# EAGLE design ecu1 (EAGLE 9.0.0)
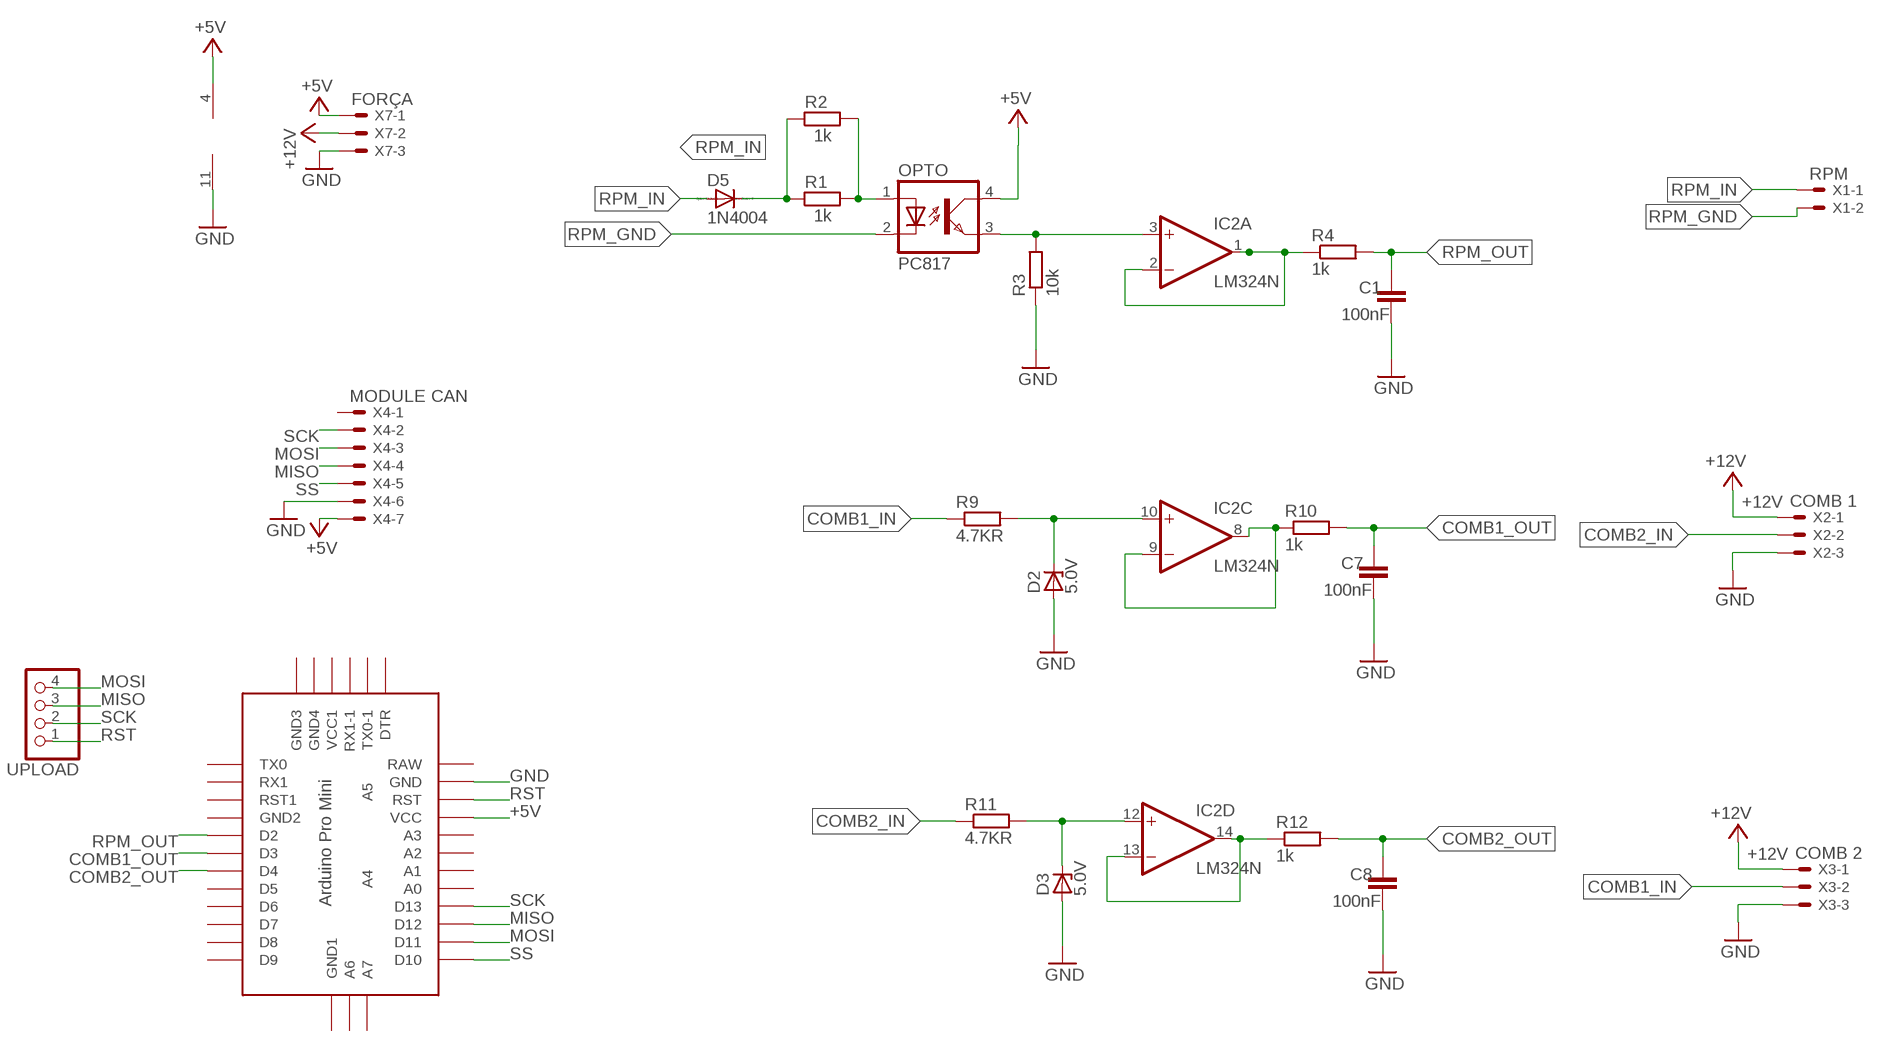
[diagram p0: schematic, sheet 1]

## Parts
C1  100nF  C5/2.5  [C5B2.5]
C7  100nF  C5/2.5  [C5B2.5]
C8  100nF  C5/2.5  [C5B2.5]
D2  5.0V  ZENER-DIODEDO34-7  [DO34Z7]
D3  5.0V  ZENER-DIODEDO34-7  [DO34Z7]
D5  1N4004  [DO41-10]
IC2  LM324N  [DIL14]
OPTO  PC817  [DIL04]
R1  1k  R-EU_0207/7  [0207/7]
R2  1k  R-EU_0207/7  [0207/7]
R3  10k  R-EU_0207/7  [0207/7]
R4  1k  R-EU_0207/7  [0207/7]
R9  4.7KR  R-EU_0207/7  [0207/7]
R10  1k  R-EU_0207/7  [0207/7]
R11  4.7KR  R-EU_0207/7  [0207/7]
R12  1k  R-EU_0207/7  [0207/7]
U$1  ABK-PRO-MINI  [ABK-PRO-MINI]
UPLOAD  PINHD-1X4  [1X04]
X1  RPM  22-23-2021  [22-23-2021]
X2  COMB 1  22-23-2031  [22-23-2031]
X3  COMB 2  22-23-2031  [22-23-2031]
X4  MODULE CAN  22-23-2071  [22-23-2071]
X7  FORÇA  22-23-2031  [22-23-2031]

## Nets
+5V [ALIMENTACAO]: IC2.4(P:V+) OPTO.4(COL) U$1.VCC X4.7 X7.1
+12V [ALIMENTACAO]: X2.1 X3.1 X7.2
COMB1_IN [ALIMENTACAO]: R9.1 X3.2
COMB1_OUT: C7.2 R10.2 U$1.D3
COMB2_IN [ALIMENTACAO]: R11.1 X2.2
COMB2_OUT: C8.2 R12.2 U$1.D4
GND [ALIMENTACAO]: C1.1 C7.1 C8.1 D2.A D3.A IC2.11(P:V-) R3.1 U$1.GND X2.3 X3.3 X4.6 X7.3
MISO: U$1.D12 UPLOAD.3 X4.4
MOSI: U$1.D11 UPLOAD.4 X4.3
N$1 [ALIMENTACAO]: OPTO.1(A) R1.2 R2.2
N$2 [ALIMENTACAO]: D5.C R1.1 R2.1
N$3 [ALIMENTACAO]: IC2.1(A:OUT) IC2.2(A:-IN) R4.1
N$5: D2.C IC2.10(C:+IN) R9.2
N$7 [ALIMENTACAO]: IC2.3(A:+IN) OPTO.3(EMIT) R3.2
N$12: IC2.8(C:OUT) IC2.9(C:-IN) R10.1
N$13: D3.C IC2.12(D:+IN) R11.2
N$14: IC2.13(D:-IN) IC2.14(D:OUT) R12.1
RPM_GND [ALIMENTACAO]: OPTO.2(C) X1.2
RPM_IN [ALIMENTACAO]: D5.A X1.1
RPM_OUT [ALIMENTACAO]: C1.2 R4.2 U$1.D2
RST: U$1.RST UPLOAD.1
SCK: U$1.D13 UPLOAD.2 X4.2
SS: U$1.D10 X4.5
Unconnected: IC2.5(B:+IN) IC2.6(B:-IN) IC2.7(B:OUT) U$1.A0 U$1.A1 U$1.A2 U$1.A3 U$1.A4 U$1.A5 U$1.A6 U$1.A7 U$1.D5 U$1.D6 U$1.D7 U$1.D8 U$1.D9 U$1.DTR U$1.GND1(GND2) U$1.GND2(GND3) U$1.GND3(GND4) U$1.GND4(GND1) U$1.RAW U$1.RST1 U$1.RX1 U$1.RX1-1 U$1.TX0 U$1.TX0-1 U$1.VCC1 X4.1

## Library data of the parts
C1 C7 C8 = capacitor-wima:C: CAPACITOR naming: grid - package width
D2 D3 = diode:ZENER-DIODE: Z-Diode
D5 = diode:1N4004: DIODE general purpose rectifier, 1 A
IC2 = linear:LM324: OP AMP
OPTO = optocoupler:PC817: SHARP OPTO COUPLER; MPN: PC817X4J000F; OC_FARNELL: 9707727; OC_NEWARK: 97K7059
R1-R4 R9-R12 = resistor:R-EU_: RESISTOR, European symbol
U$1 = Arduino-clone:ABK-PRO-MINI: ABK Pro-Mini Arduino Clone
UPLOAD = pinhead:PINHD-1X4: PIN HEADER
X1 = con-molex:22-23-2021: .100" (2.54mm) Center Header - 2 Pin; MF: MOLEX; MPN: 22-23-2021; OC_FARNELL: 1462926; OC_NEWARK: 25C3832
X2 X3 X7 = con-molex:22-23-2031: .100" (2.54mm) Center Header - 3 Pin; MF: MOLEX; MPN: 22-23-2031; OC_FARNELL: 1462950; OC_NEWARK: 30C0862
X4 = con-molex:22-23-2071: .100" (2.54mm) Center Header - 7 Pin; MF: MOLEX; MPN: 22-23-2071; OC_FARNELL: 1654534; OC_NEWARK: 56H0445

## Net classes
0 default: width 1.27 mm
1 ALIMENTACAO: width 0.635 mm

## Board
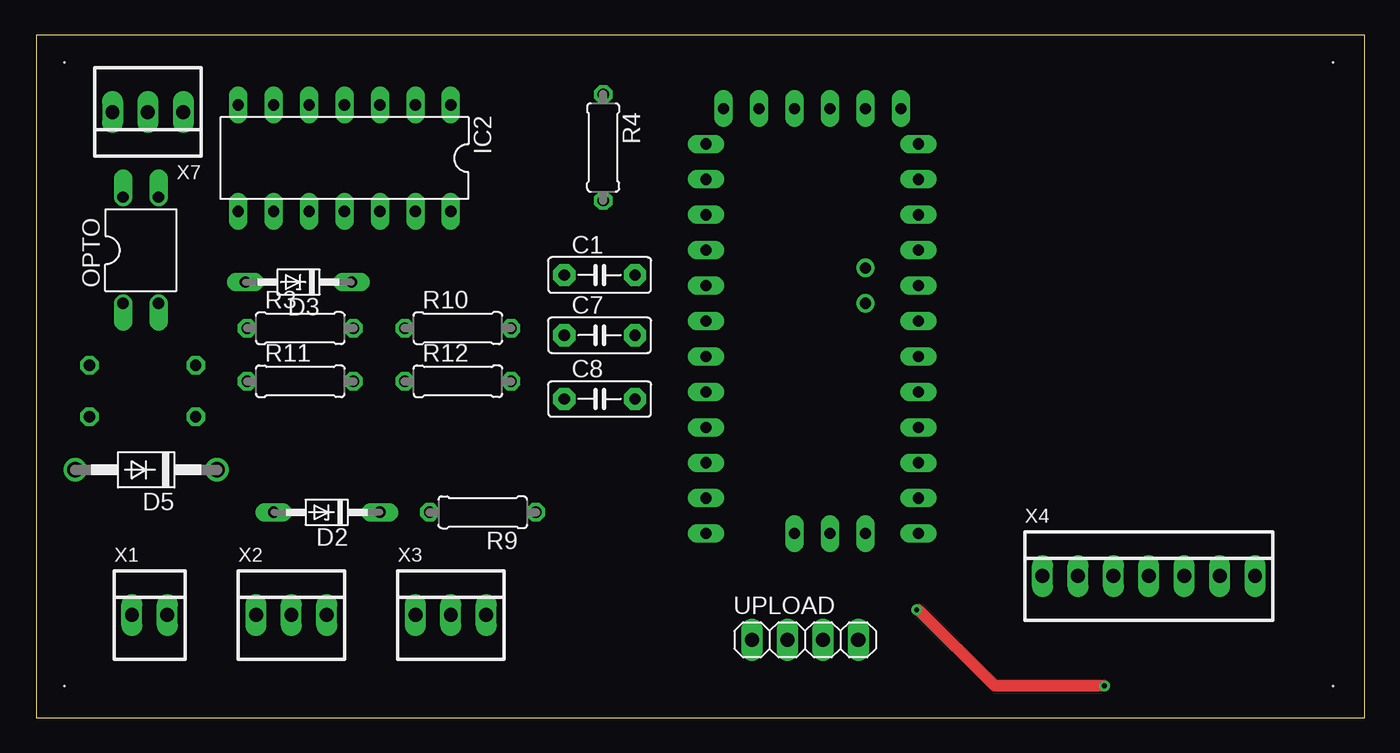
[diagram p1: board, top side]
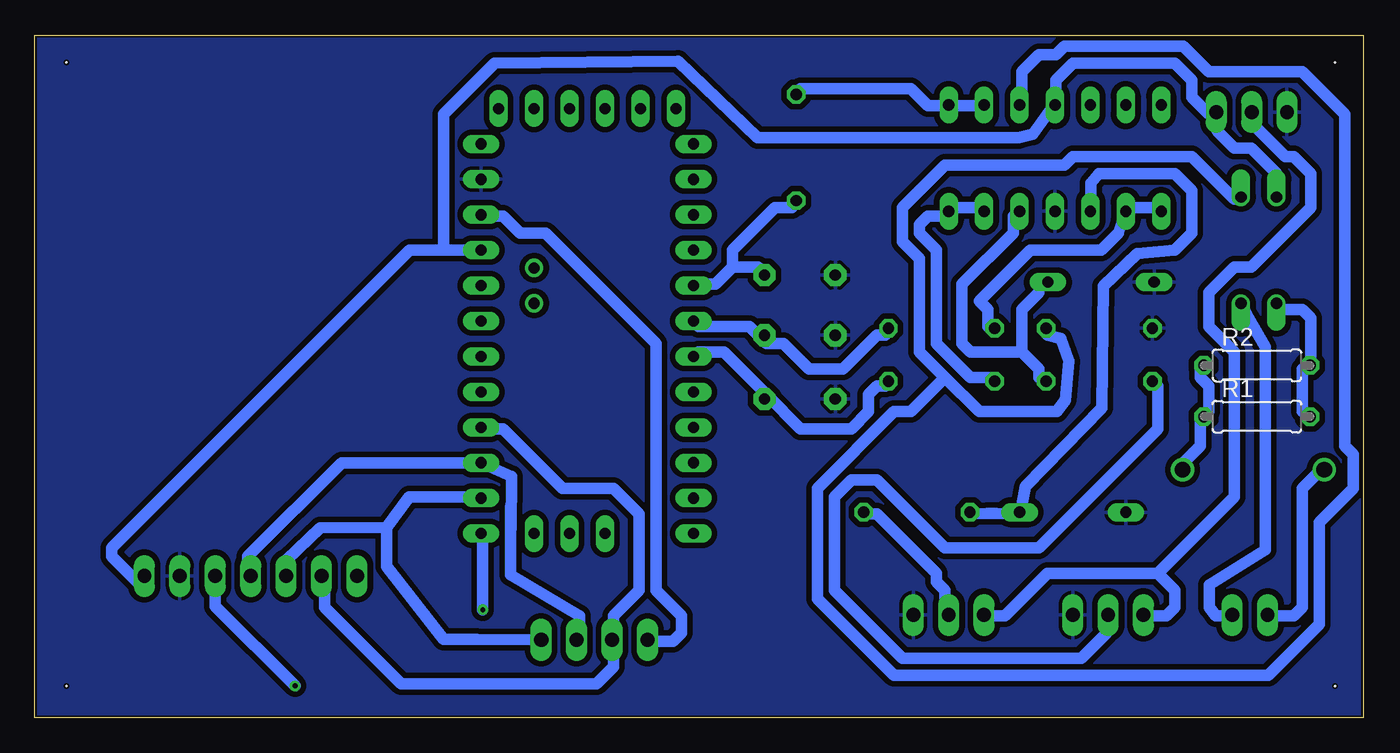
[diagram p2: board, bottom side, seen from below]

Size 95.23 x 48.95 mm. Coordinates in mm from the lower left corner, seen from the top.
Outline: 0,0 95.23,0 95.23,48.95 0,48.95 0,0
Copper layers (1*16): Top 0.035mm / dielectric 1.5mm / Bottom 0.035mm
Design rules "default *": minimum track width 32mil, minimum drill 0.35mm, track to track 16mil, track to pad 16mil, pad to pad 16mil, via to via 16mil, smd to smd 16mil, copper to edge 6mil, drill to drill 6mil, minimum pad ring 10mil, minimum via ring 8mil, stop-mask expansion 4mil, vias tented up to drill 0mil, thermal gap 10mil
Holes 0.08 mm at 2.03,46.99 92.96,46.99 92.96,2.29 2.03,2.29

### Footprints (pad centres in the part's own frame; a part is rotated, then mirrored left to right if it is on the bottom)
C5B2.5 = drill 0.813 pad 1.6 octagon: 1 -2.54,0; 2 2.54,0
DO34Z7 = drill 0.813 long: A 3.81,0; C -3.81,0
DO41-10 = drill 1.118: A 5.08,0; C -5.08,0
DIL14 = drill 0.813 long: 1 -7.62,-3.81; 2 -5.08,-3.81; 3 -2.54,-3.81; 4 0,-3.81; 5 2.54,-3.81; 6 5.08,-3.81; 7 7.62,-3.81; 8 7.62,3.81; 9 5.08,3.81; 10 2.54,3.81; 11 0,3.81; 12 -2.54,3.81; 13 -5.08,3.81; 14 -7.62,3.81
DIL04 = drill 0.813 offset: 1 -1.27,-3.81; 2 1.27,-3.81; 3 1.27,3.81; 4 -1.27,3.81
0207/7 = drill 0.813 octagon: 1 -3.81,0; 2 3.81,0
ABK-PRO-MINI = drill 0.8 long: A0 10.16,-3.81; A1 10.16,-6.35; A2 10.16,-8.89; A3 10.16,-11.43; A6 3.81,-21.59; A7 6.35,-21.59; D2 -5.08,-3.81; D3 -5.08,-6.35; D4 -5.08,-8.89; D5 -5.08,-11.43; D6 -5.08,-13.97; D7 -5.08,-16.51; D8 -5.08,-19.05; D9 -5.08,-21.59; D10 10.16,-21.59; D11 10.16,-19.05; D12 10.16,-16.51; D13 10.16,-13.97; DTR 8.89,8.89; GND 10.16,3.81; GND1 -5.08,-1.27; GND2 -3.81,8.89; GND3 -1.27,8.89; GND4 1.27,-21.59; RAW 10.16,6.35; RST 10.16,1.27; RST1 -5.08,1.27; RX1 -5.08,3.81; RX1-1 3.81,8.89; TX0 -5.08,6.35; TX0-1 6.35,8.89; VCC 10.16,-1.27; VCC1 1.27,8.89 | drill 0.8: A4 6.35,-5.08; A5 6.35,-2.54
1X04 = drill 1.016 long: 1 -3.81,0; 2 -1.27,0; 3 1.27,0; 4 3.81,0
22-23-2021 = drill 1 long: 1 -1.27,0; 2 1.27,0
22-23-2031 = drill 1 long: 1 -2.54,0; 2 0,0; 3 2.54,0
22-23-2071 = drill 1 long: 1 -7.62,0; 2 -5.08,0; 3 -2.54,0; 4 0,0; 5 2.54,0; 6 5.08,0; 7 7.62,0

### Placement (x,y rotation side)
C1  40.39,31.75 0 top
C7  40.39,27.43 0 top
C8  40.39,22.86 0 top
D2  20.83,14.73 180 top
D3  18.8,31.24 180 top
D5  7.87,17.78 180 top
IC2  22.1,40.13 180 top
OPTO  7.49,33.53 0 top
R1  7.62,21.59 0 bottom
R2  7.62,25.27 0 bottom
R3  18.92,27.94 0 top
R4  40.64,40.89 270 top
R9  32,14.73 180 top
R10  30.23,27.94 0 top
R11  18.92,24.13 0 top
R12  30.23,24.13 0 top
U$1  53.09,34.8 0 top
UPLOAD  55.12,5.59 0 top
X1  8.13,7.37 0 top
X2  18.29,7.37 0 top
X3  29.72,7.37 0 top
X4  79.76,10.16 0 top
X7  8,43.43 180 top

### Tracks (layer width: path | path; a pad name or v marks a point on that pad's centre or on a via)
+5V
  Bottom 0.813: OPTO.4 6.2,37.8 6.2,39.01 8.03,40.84 9.25,40.84 10.46,42.06 10.46,43.28 X7.1 11.07,43.28 12.29,44.5 12.29,45.72 13.51,46.94 20.83,46.94 22.05,45.72 22.05,44.5 IC2.4 22.05,44.14 23.7,41.83 24.69,41.6 43.41,41.6 49.12,47.07 62.28,46.94 65.94,43.28 65.94,33.53 | 65.94,33.53 68.38,33.53 89.71,12.19 89.71,11.58 87.88,9.75 X4.7 | 65.94,33.53 U$1.VCC
+12V
  Bottom 0.813: 14.73,10.36 13.51,9.14 13.51,7.93 14.12,7.32 15.34,7.32 X2.1 | 14.73,10.36 22.66,10.36 25.7,7.32 26.92,7.32 X3.1 | 14.73,10.36 9.25,15.85 9.25,26.21 11.07,28.04 11.07,30.48 9.25,32.31 8.03,32.31 3.76,36.58 3.76,39.01 4.98,40.23 5.59,40.23 8.03,42.67 8.03,43.28 X7.2
COMB1_IN
  Bottom 0.813: R9.1 35.46,14.63 34.85,14.63 30.58,10.36 30.58,9.75 29.97,9.14 29.97,7.93 X3.2
COMB1_OUT
  Bottom 0.813: 43.38,27.43 43.99,28.04 47.65,28.04 U$1.D3 | 43.38,27.43 42.77,26.82 41.55,26.82 39.73,24.99 37.29,24.99 34.85,27.43 34.24,27.43 R10.2 | 43.38,27.43 C7.2
COMB2_IN
  Bottom 0.813: R11.1 14.73,23.77 14.73,20.73 23.27,12.19 29.97,12.19 34.85,17.07 36.68,17.07 37.9,15.85 37.9,9.14 33.02,4.27 20.22,4.27 18.39,6.1 18.39,7.32 X2.2
COMB2_OUT
  Bottom 0.813: 42.77,23.17 45.82,26.21 47.65,26.21 U$1.D4 | 42.77,23.17 40.33,20.73 36.68,20.73 35.46,21.95 35.46,23.17 34.85,23.77 34.24,23.77 R12.2 | 42.77,23.17 C8.2
GND
  pour Bottom: 0.25,48.77 0.25,0.13 95,0.13 95,48.77
MISO
  Bottom 0.813: X4.4 79.96,10.36 79.96,11.58 73.25,18.29 U$1.D12 61.06,17.3 61.09,13.54 61.14,14.02 61.11,15.11 61.14,10.26 56.19,7.32 56.19,6.1 UPLOAD.3
MOSI
  Bottom 0.813: 70,13.64 70,10.85 65.91,5.61 63.55,5.61 UPLOAD.4 | 70,13.64 68.4,15.85 63.5,15.85 U$1.D11 | 70,13.64 74.78,13.61 77.19,11.33 77.19,9.09 X4.3
N$1
  Bottom 0.813: R1.2 4.37,21.95 4.37,24.99 R2.2 3.76,25.6 3.76,28.65 4.37,29.26 6.2,29.26 OPTO.1
N$2
  Bottom 0.813: R2.1 11.68,24.99 11.68,24.38 11.07,23.77 11.07,21.95 R1.1 11.68,21.34 11.68,19.51 12.9,18.29 D5.C
N$3
  Bottom 0.813: IC2.2 27.53,43.89 29.36,43.89 IC2.1 29.97,43.89 31.19,43.89 32.41,45.11 40.33,45.11 R4.1
N$5
  Bottom 0.813: R9.2 28.14,14.63 26.95,14.66 26.34,14.66 25.09,14.63 D2.C 24.49,15.24 24.23,16.59 18.74,22.2 18.62,30.96 16.18,33.27 13.51,33.53 12.29,34.75 12.29,37.8 13.51,39.01 18.95,39.01 19.51,38.35 19.51,37.21 19.56,36.65 IC2.10
N$7
  Bottom 0.813: 29.97,24.38 31.8,26.21 31.8,32.92 33.02,34.14 33.02,36.58 29.97,39.62 21.44,39.62 20.83,40.23 12.29,40.23 9.25,37.19 OPTO.3 | 29.97,24.38 27.53,21.95 21.95,21.95 21.36,22.78 21.11,25.58 21.69,27.18 22.66,27.43 R3.2 | 29.97,24.38 32.41,21.95 33.63,21.95 39.12,16.46 39.12,8.53 33.63,3.05 6.81,3.05 3.15,6.71 3.15,14.02 0.71,16.46 0.71,18.9 1.32,19.51 1.32,43.28 4.37,46.33 11.07,46.33 12.9,48.16 21.44,48.16 22.05,47.55 23.27,47.55 24.49,46.33 24.49,44.5 IC2.3
N$12
  Bottom 0.813: IC2.8 14.73,36.58 16.56,36.58 IC2.9 17.17,35.97 17.55,34.75 18.77,33.53 23.88,33.53 27.53,29.87 26.92,29.26 26.92,28.04 R10.1
N$13
  Bottom 0.813: 24.49,26.21 23.27,24.99 23.27,24.38 R11.2 | 24.49,26.21 24.49,29.26 23.27,30.48 23.27,31.09 22.66,31.19 D3.C | 24.49,26.21 28.14,26.21 28.75,26.82 28.75,31.09 25.09,34.75 25.09,35.97 IC2.12
N$14
  Bottom 0.813: R12.1 26.92,24.38 28.14,24.38 30.58,26.82 30.58,33.53 31.8,34.75 31.8,35.36 31.19,35.97 29.97,35.97 IC2.14 29.36,36.58 27.53,36.58 IC2.13
RPM_GND
  Bottom 0.813: OPTO.2 8.25,28.7 7.01,26.57 7.01,12.04 11.05,9.53 11.05,7.93 10.57,7.32 9.85,7.32 X1.2
RPM_IN
  Bottom 0.813: X1.1 6.81,7.32 4.98,7.32 4.37,7.93 4.37,16.46 3.15,17.68 D5.A
RPM_OUT
  Bottom 0.813: 45.21,32.31 46.43,31.09 47.65,31.09 U$1.D2 | 45.21,32.31 43.38,32.31 C1.2 | 45.21,32.31 45.21,33.53 42.16,36.58 40.94,36.58 R4.2
RST
  Bottom 0.813: U$1.RST 62.89,35.97 61.67,35.97 60.45,34.75 58.62,34.75 50.7,26.82 50.7,9.14 48.87,7.32 48.87,6.1 49.48,5.49 51.31,5.49 UPLOAD.1
SCK
  Bottom 0.813: U$1.D13 62.89,20.73 61.67,20.73 57.4,16.46 53.75,16.46 51.92,14.63 51.92,9.14 53.75,7.32 53.75,6.1 UPLOAD.2 53.75,5.49 53.75,3.66 54.97,2.44 68.99,2.44 74.47,7.93 74.47,9.75 X4.2
SS  (via drill 0.35)
  Top 0.813: v76.58,2.29 68.71,2.29 63.25,7.75 v63.12,7.75
  Bottom 0.813: X4.5 82.3,8 v76.58,2.29 | v63.12,7.75 63.12,13.08 U$1.D10